# Altium schematic sheet Microcontroller.SchDoc
size B
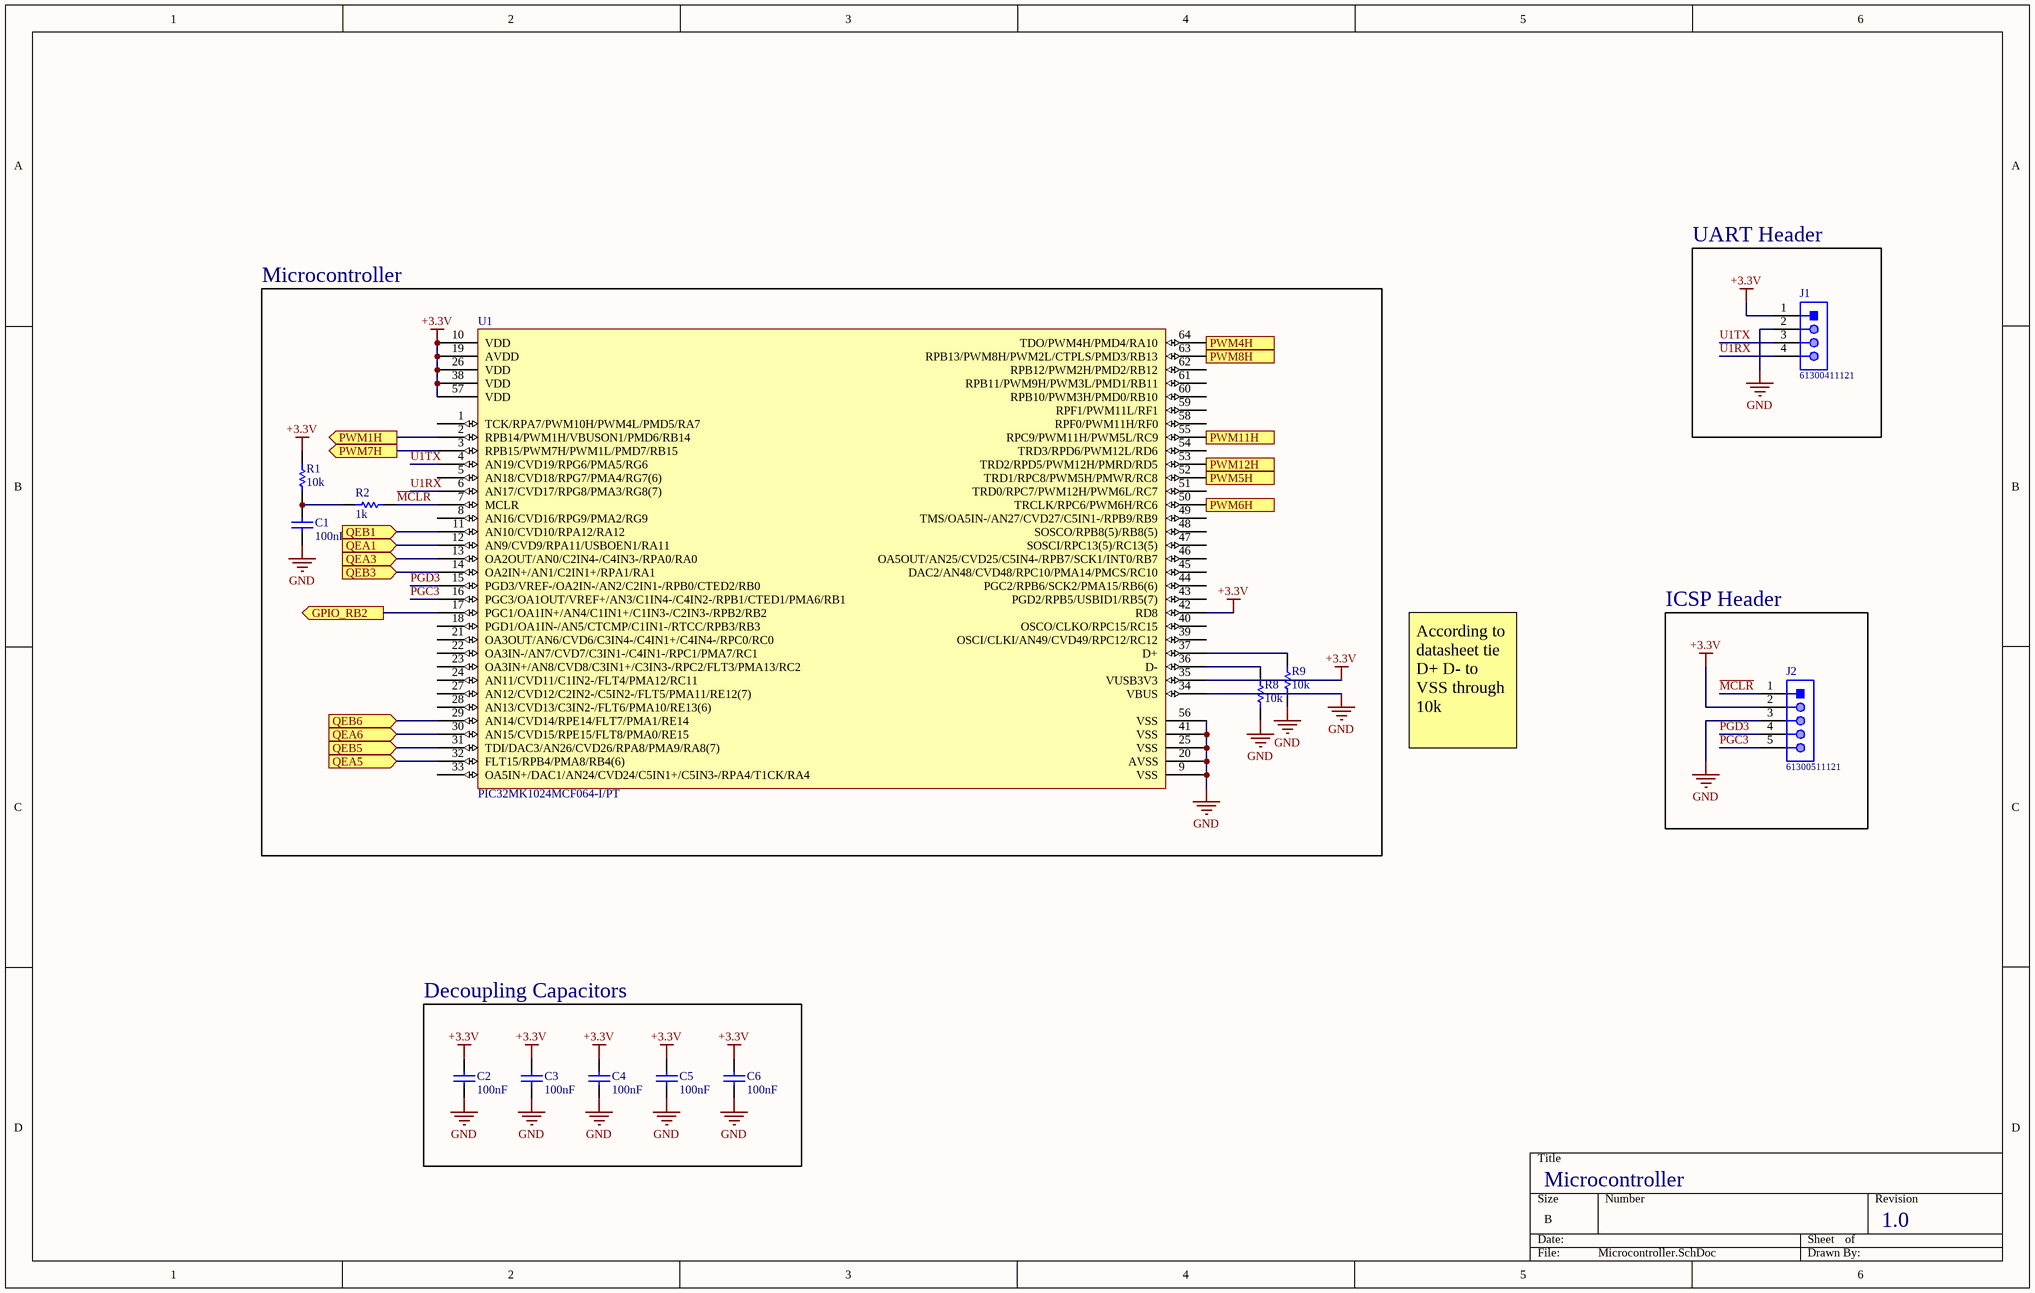
[diagram p0: Microcontroller.SchDoc]

## Parts
C1  100nF  [0402]
C2  100nF  [0402]
C3  100nF  [0402]
C4  100nF  [0402]
C5  100nF  [0402]
C6  100nF  [0402]
J1  61300411121  [61300411121]
J2  61300511121  [61300511121]
R1  10k  [0402]
R2  1k  [0402]
R8  10k  [0402]
R9  10k  [0402]
U1  PIC32MK1024MCF064-I/PT  [64-TQFP]

## Blocks framed on the sheet
UART Header: J1
Microcontroller: C1 R1 R2 R8 R9 U1
ICSP Header: J2
Decoupling Capacitors: C2-C6

## Ports
GPIO_RB2 (out), PWM1H (out), PWM4H (out), PWM5H (out), PWM6H (out), PWM7H (out), PWM8H (out), PWM11H (out), PWM12H (out), QEA1 (in), QEA3 (in), QEA5 (in), QEA6 (in), QEB1 (in), QEB3 (in), QEB5 (in), QEB6 (in)

## Nets
+3.3V: C2.2 C3.2 C4.2 C5.2 C6.2 J1.1 J2.2 R1.2 U1.10(VDD) U1.19(AVDD) U1.26(VDD) U1.35(VUSB3V3) U1.38(VDD) U1.42(RD8) U1.57(VDD)
GND: C1.1 C2.1 C3.1 C4.1 C5.1 C6.1 J1.2 J2.3 R8.1 R9.1 U1.9(VSS) U1.20(AVSS) U1.25(VSS) U1.34(VBUS) U1.41(VSS) U1.56(VSS)
GPIO_RB2: U1.17(PGC1/OA1IN+/AN4/C1IN1+/C1IN3-/C2IN3-/RPB2/RB2) ; port GPIO_RB2
~{MCLR}: J2.1 R2.2 U1.7(MCLR)
PGC3: J2.5 U1.16(PGC3/OA1OUT/VREF+/AN3/C1IN4-/C4IN2-/RPB1/CTED1/PMA6/RB1)
PGD3: J2.4 U1.15(PGD3/VREF-/OA2IN-/AN2/C2IN1-/RPB0/CTED2/RB0)
PWM1H: U1.2(RPB14/PWM1H/VBUSON1/PMD6/RB14) ; port PWM1H
PWM4H: U1.64(TDO/PWM4H/PMD4/RA10) ; port PWM4H
PWM5H: U1.52(TRD1/RPC8/PWM5H/PMWR/RC8) ; port PWM5H
PWM6H: U1.50(TRCLK/RPC6/PWM6H/RC6) ; port PWM6H
PWM7H: U1.3(RPB15/PWM7H/PWM1L/PMD7/RB15) ; port PWM7H
PWM8H: U1.63(RPB13/PWM8H/PWM2L/CTPLS/PMD3/RB13) ; port PWM8H
PWM11H: U1.55(RPC9/PWM11H/PWM5L/RC9) ; port PWM11H
PWM12H: U1.53(TRD2/RPD5/PWM12H/PMRD/RD5) ; port PWM12H
QEA1: U1.12(AN9/CVD9/RPA11/USBOEN1/RA11) ; port QEA1
QEA3: U1.13(OA2OUT/AN0/C2IN4-/C4IN3-/RPA0/RA0) ; port QEA3
QEA5: U1.32(FLT15/RPB4/PMA8/RB4(6)) ; port QEA5
QEA6: U1.30(AN15/CVD15/RPE15/FLT8/PMA0/RE15) ; port QEA6
QEB1: U1.11(AN10/CVD10/RPA12/RA12) ; port QEB1
QEB3: U1.14(OA2IN+/AN1/C2IN1+/RPA1/RA1) ; port QEB3
QEB5: U1.31(TDI/DAC3/AN26/CVD26/RPA8/PMA9/RA8(7)) ; port QEB5
QEB6: U1.29(AN14/CVD14/RPE14/FLT7/PMA1/RE14) ; port QEB6
U1RX: J1.4 U1.6(AN17/CVD17/RPG8/PMA3/RG8(7))
U1TX: J1.3 U1.4(AN19/CVD19/RPG6/PMA5/RG6)
NetC1_2: C1.2 R1.1 R2.1
NetR8_2: R8.2 U1.36(D-)
NetR9_2: R9.2 U1.37(D+)

Not connected (* = marked no-connect by the designer): U1 1(TCK/RPA7/PWM10H/PWM4L/PMD5/RA7) 5(AN18/CVD18/RPG7/PMA4/RG7(6)) 8(AN16/CVD16/RPG9/PMA2/RG9) 18(PGD1/OA1IN-/AN5/CTCMP/C1IN1-/RTCC/RPB3/RB3) 21(OA3OUT/AN6/CVD6/C3IN4-/C4IN1+/C4IN4-/RPC0/RC0) 22(OA3IN-/AN7/CVD7/C3IN1-/C4IN1-/RPC1/PMA7/RC1) 23(OA3IN+/AN8/CVD8/C3IN1+/C3IN3-/RPC2/FLT3/PMA13/RC2) 24(AN11/CVD11/C1IN2-/FLT4/PMA12/RC11) 27(AN12/CVD12/C2IN2-/C5IN2-/FLT5/PMA11/RE12(7)) 28(AN13/CVD13/C3IN2-/FLT6/PMA10/RE13(6)) 33(OA5IN+/DAC1/AN24/CVD24/C5IN1+/C5IN3-/RPA4/T1CK/RA4) 39(OSCI/CLKI/AN49/CVD49/RPC12/RC12) 40(OSCO/CLKO/RPC15/RC15) 43(PGD2/RPB5/USBID1/RB5(7)) 44(PGC2/RPB6/SCK2/PMA15/RB6(6)) 45(DAC2/AN48/CVD48/RPC10/PMA14/PMCS/RC10) 46(OA5OUT/AN25/CVD25/C5IN4-/RPB7/SCK1/INT0/RB7) 47(SOSCI/RPC13(5)/RC13(5)) 48(SOSCO/RPB8(5)/RB8(5)) 49(TMS/OA5IN-/AN27/CVD27/C5IN1-/RPB9/RB9) 51(TRD0/RPC7/PWM12H/PWM6L/RC7) 54(TRD3/RPD6/PWM12L/RD6) 58(RPF0/PWM11H/RF0) 59(RPF1/PWM11L/RF1) 60(RPB10/PWM3H/PMD0/RB10) 61(RPB11/PWM9H/PWM3L/PMD1/RB11) 62(RPB12/PWM2H/PMD2/RB12)

## Notes on the sheet
- According to datasheet tie D+ D- to VSS through 10k
- Microcontroller
- 1.0

## Library data of the parts
C1-C6 = C1005X7R1C104K050BC: TDK - C1005X7R1C104K050BC. - CERAMIC CAPACITOR, 0.1UF, 16V, X7R, 10%, 0402, FULL REEL; Part Name: C1005X7R1C104K050BC; Supplier 1: Digi-Key; Supplier Part Number 1: 445-4952-1-ND; Manufacturer: TDK; Manufacturer Part Number: C1005X7R1C104K050BC; RoHS: Yes; Category: Ceramic Capacitors; Stock 1: 2957810; Pricing 1: 1=0.10000, 10=0.07500, 100=0.03350, 500=0.02390, 1000=0.01879, 2500=0.01708, 5000=0.01571 (USD); Mount: Surface Mount; Case/Package: 0402; Min Operating Temperature: -55°C; Max Operating Temperature: 125°C; Termination: SMD/SMT; Voltage: 16V; Tolerance: 10%; Capacitance: 100nF; Packaging: Tape and Reel; Voltage Rating: 16V; Package Quantity: 1; Voltage Rating (DC): 16V; Length: 1mm; Height: 0.5mm; Radiation Hardening: No; REACH SVHC: Unknown; Number of Pins: 2; Weight: 2.3E-05oz; Case Code (Metric): 1005; Case Code (Imperial): 0402; Dielectric Material: Ceramic; Dielectric: X7R; Composition: Ceramic; Depth: 0.5mm; Thickness: 0.022inch; Width: 0.02inch; Lead Free: Lead Free
J1 = CMP-1502-01064-1: THT Vertical Pin Header WR-PHD, Pitch 2.54 mm, Single Row, 4 pins; Manufacturer: Wurth Elektronik; Withstanding Voltage: 500VAC; Rated Current: 3A; Working Voltage: 250VAC; Pin Number: 4; Gender: Male; Contact Resistance: 20mOhm; Pitch: 2.54mm; Manufacturer URL: http://www.we-online.de; Operating Temperature: -40to105degC; Packaging: Bag; Mounting Technology: THT; Package Reference: 61300411121; Datasheet URL: https://katalog.we-online.de/em/datasheet/6130xx11121.pdf; Publisher: WurthElektronik; Part Number: 61300411121; Row Number: Single; Orientation: Vertical
J2 = CMP-1502-01068-1: THT Vertical Pin Header WR-PHD, Pitch 2.54 mm, Single Row, 5 pins; Manufacturer: Wurth Elektronik; Pin Number: 5; Contact Resistance: 20mOhm; Working Voltage: 250VAC; Pitch: 2.54mm; Withstanding Voltage: 500VAC; Rated Current: 3A; Gender: Male; Datasheet URL: https://katalog.we-online.de/em/datasheet/6130xx11121.pdf; Orientation: Vertical; Mounting Technology: THT; Row Number: Single; Package Reference: 61300511121; Publisher: WurthElektronik; Part Number: 61300511121; Packaging: Bag; Manufacturer URL: http://www.we-online.de; Operating Temperature: -40to105degC
R1 R8 R9 = CRCW040210K0FKEDC: D10/CRCW0402-C 100 10K 1% ET7; Manufacturer: Vishay; Power Rating: 62.5mW; Temperature Coefficient: 100ppm/°C; Part Name: CRCW040210K0FKEDC; Supplier 1: Digi-Key; Supplier Part Number 1: 541-3959-6-ND; Manufacturer Part Number: CRCW040210K0FKEDC; RoHS: Yes; Category: Resistors; Stock 1: 3541307; Pricing 1: 1=0.10000, 10=0.03200, 100=0.01300, 1000=0.00583, 2500=0.00506, 5000=0.00418 (USD); Case/Package: Molded; Contact Plating: Tin; Min Operating Temperature: -55°C; Max Operating Temperature: 155°C; Tolerance: 1%; Termination: Wraparound; Resistance: 10k; Composition: Thick Film; Length: 1mm; Lead Free: Lead Free
R2 = CRCW04021K00FKED: Res Thick Film 0402 1K Ohm 1% 1/16W ±100ppm/°C Molded SMD Paper T/R; Manufacturer: Vishay Dale; Part Name: CRCW04021K00FKED; Supplier 1: Digi-Key; Supplier Part Number 1: 541-1.00KLDKR-ND; Manufacturer Part Number: CRCW04021K00FKED; RoHS: Yes; Category: Chip SMD Resistors; Stock 1: 767306; Pricing 1: 1=0.10000, 10=0.03600, 100=0.01460, 1000=0.00657, 2500=0.00570, 5000=0.00471 (USD); Tolerance: 1%; Resistance: 1k
U1 = PIC32MK1024MCF064-I/PT: IC MCU 32BIT 1MB FLASH 64TQFP; Manufacturer: Microchip; Part Name: PIC32MK1024MCF064-I/PT; Supplier 1: Digi-Key; Supplier Part Number 1: PIC32MK1024MCF064-I/PT-ND; Manufacturer Part Number: PIC32MK1024MCF064-I/PT; RoHS: No; Category: Microcontrollers; Stock 1: 2; Pricing 1: 1=7.30000, 25=6.70000, 100=6.06000 (USD); ComponentLink1URL: http://www.farnell.com/datasheets/2302007.pdf?src-supplier=Farnell; ComponentLink1Description: http://www.farnell.com/datasheets/2302007.pdf?src-supplier=Farnell; ComponentLink2URL: http://www.microchip.com/mymicrochip/filehandler.aspx?ddocname=en597535&src-supplier=Digi-Key; ComponentLink2Description: http://www.microchip.com/mymicrochip/filehandler.aspx?ddocname=en597535&src-supplier=Digi-Key